# Altium schematic sheet 24V_Buck_3_3V.SchDoc
size A; SheetNumber: 13; SheetTotal: 13
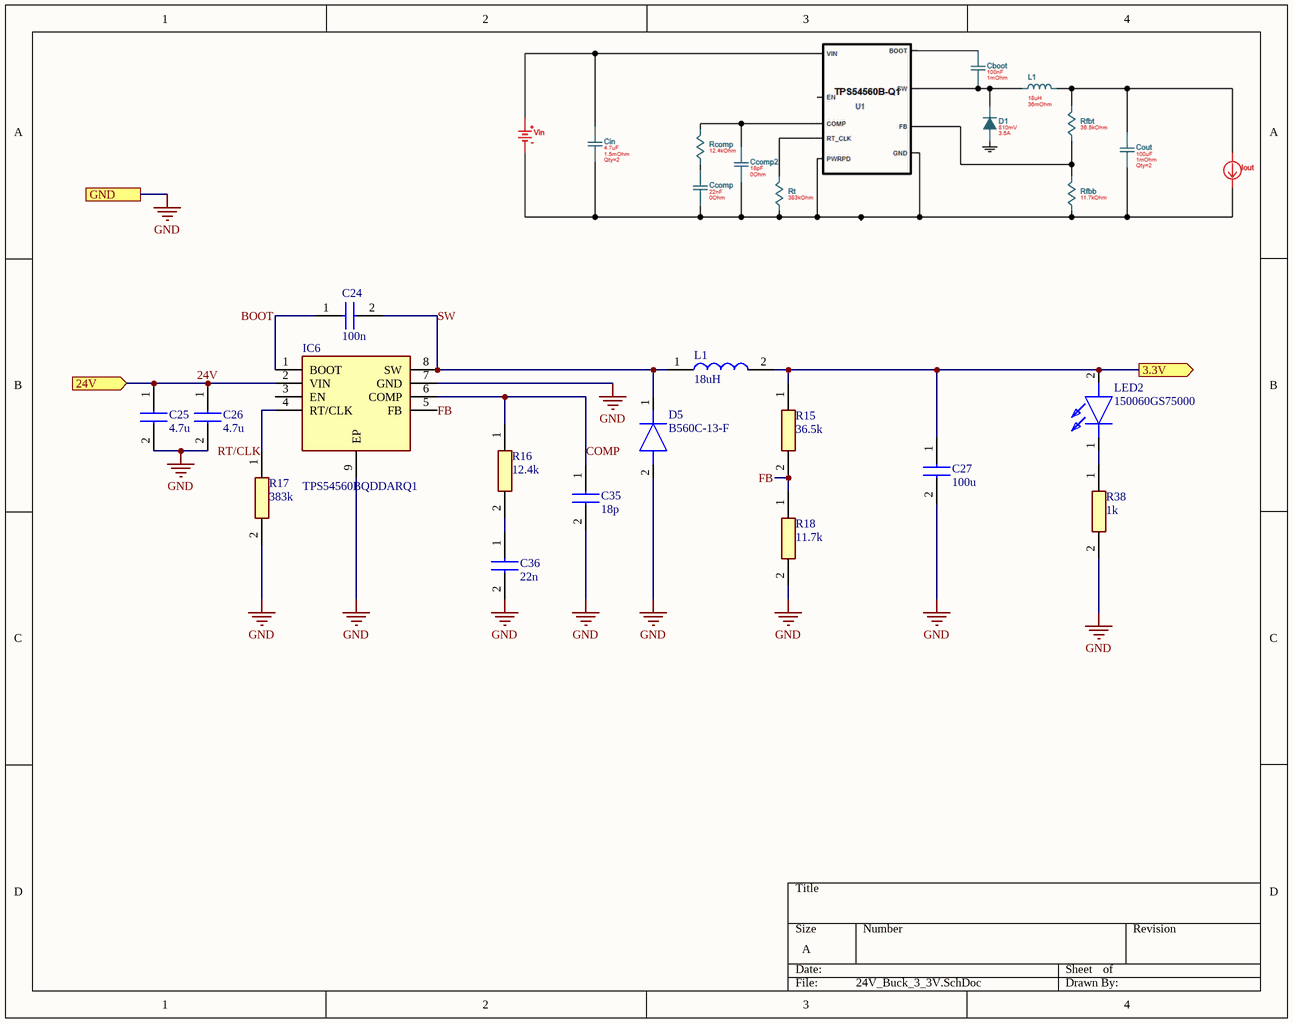
[diagram p0: 24V_Buck_3_3V.SchDoc]

## Parts
C24  100n  [CAPC1608X90N]
C25  4.7u  [CAPC2012X145N]
C26  4.7u  [CAPC2012X145N]
C27  100u  [CAPC3216X190N]
C35  18p  [CAPC1608X90N]
C36  22n  [CAPC1608X87N]
D5  B560C-13-F  [DIOM7959X250N]
IC6  TPS54560BQDDARQ1  [SOIC127P600X170-9N]
L1  18uH  [INDPM125125X800N]
LED2  150060GS75000  [LEDC1608X70N]
R15  36.5k  [RESC1608X55N]
R16  12.4k  [RESC1608X50N]
R17  383k  [RESC1608X55N]
R18  11.7k  [CAPC1608X55N]
R38  1k  [RESC1608X55N]

## Ports
3.3V (out), 24V (in), GND

## Nets
GND: C25.2 C26.2 C27.2 C35.2 C36.2 D5.2(A) IC6.7(GND) IC6.9(EP) R17.2 R18.2 R38.2 ; port GND
3.3V: C27.1 L1.2 LED2.2(A) R15.1 ; port 3.3V
24V: C25.1 C26.1 IC6.2(VIN) ; port 24V
BOOT: C24.1 IC6.1(BOOT)
COMP: C35.1 IC6.6(COMP) R16.1
FB: IC6.5(FB) R15.2 R18.1
RT/CLK: IC6.4(RT/CLK) R17.1
SW: C24.2 D5.1(K) IC6.8(SW) L1.1
NetC36_1: C36.1 R16.2
NetLED2_1: LED2.1(K) R38.1

Not connected (* = marked no-connect by the designer): IC6 3(EN)

## Library data of the parts
C24 = 06035C104J4Z2A: Capacitor; Manufacturer_Name: Kyocera AVX; Datasheet Link: https://componentsearchengine.com/Datasheets/1/06031A100FAT2A.pdf; Height: 0.9mm; Manufacturer_Part_Number: 06035C104J4Z2A; Mouser Part Number: 581-06035C104J4Z2A; Mouser Price/Stock: https://www.mouser.co.uk/ProductDetail/KYOCERA-AVX/06035C104J4Z2A?qs=Awwwc1gvTnlncvTGCFZvkw%3D%3D; Arrow Part Number: 06035C104J4Z2A; Arrow Price/Stock: https://www.arrow.com/en/products/06035c104j4z2a/avx
C25 C26 = GRM21BR61H475ME51L: Capacitor; Manufacturer_Name: Murata Electronics; Datasheet Link: https://search.murata.co.jp/Ceramy/image/img/A01X/G101/ENG/GRM21BR61H475ME51-01A.pdf; Height: 1.45mm; Manufacturer_Part_Number: GRM21BR61H475ME51L; Mouser Part Number: 81-GRM21BR61H475M51L; Mouser Price/Stock: https://www.mouser.co.uk/ProductDetail/Murata-Electronics/GRM21BR61H475ME51L?qs=eeBpzGFlv%252B%2Fg0wAeHy0eJw%3D%3D; Arrow Part Number: GRM21BR61H475ME51L; Arrow Price/Stock: https://www.arrow.com/en/products/grm21br61h475me51l/murata-manufacturing?region=nac
C27 = CL31X107MQKNNWE: Capacitor; Manufacturer_Name: SAMSUNG; Datasheet Link: https://www.digikey.sg/en/products/detail/samsung-electro-mechanics/CL31X107MQKNNWE/25854287?srsltid=AfmBOoqYZ52GRQ9Xlh8bi0lGOe-KtDJ1wz9-WyaigKcCVSEueXc8l4on; Height: 1.9mm; Manufacturer_Part_Number: CL31X107MQKNNWE; Mouser Part Number: 187-CL31X107MQKNNWE; Mouser Price/Stock: https://www.mouser.co.uk/ProductDetail/Samsung-Electro-Mechanics/CL31X107MQKNNWE?qs=Jm2GQyTW%2FbjTv%252BH%2F%252BndEuA%3D%3D
C35 = 06035A180JAT4A: Capacitor; Manufacturer_Name: Kyocera AVX; Datasheet Link: https://componentsearchengine.com/Datasheets/1/06031A100FAT2A.pdf; Height: 0.9mm; Manufacturer_Part_Number: 06035A180JAT4A; Mouser Part Number: 581-06035A180JAT4A; Mouser Price/Stock: https://www.mouser.co.uk/ProductDetail/AVX/06035A180JAT4A?qs=GMfvKSOiCGHkuDR8fcucAQ%3D%3D
C36 = C0603C223K5RAC-TU: Capacitor; Manufacturer_Name: KEMET; Datasheet Link: https://www.kemet.com/specsheet/C0603C223K5RACTU; Height: 0.87mm; Manufacturer_Part_Number: C0603C223K5RAC-TU
D5 = B560C-13-F: Diode; Manufacturer_Name: Diodes Incorporated; Datasheet Link: https://datasheet.lcsc.com/szlcsc/Diodes-Incorporated-B560C-13-F_C85100.pdf; Height: 2.5mm; Manufacturer_Part_Number: B560C-13-F; Mouser Part Number: 621-B560C-F; Mouser Price/Stock: https://www.mouser.co.uk/ProductDetail/Diodes-Incorporated/B560C-13-F?qs=OC0R%252Bhozcm%252BAsjMXklZLIw%3D%3D; Arrow Part Number: B560C-13-F; Arrow Price/Stock: https://www.arrow.com/en/products/b560c-13-f/diodes-incorporated?utm_currency=USD&region=nac
IC6 = TPS54560BQDDARQ1: Integrated Circuit; Manufacturer_Name: Texas Instruments; Datasheet Link: http://www.ti.com/lit/gpn/tps54560b-q1; Height: 1.7mm; Manufacturer_Part_Number: TPS54560BQDDARQ1; Mouser Part Number: 595-TPS54560BQDDARQ1; Mouser Price/Stock: https://www.mouser.co.uk/ProductDetail/Texas-Instruments/TPS54560BQDDARQ1?qs=Mv7BduZupUi0AsDfghsxzg%3D%3D; Arrow Part Number: TPS54560BQDDARQ1; Arrow Price/Stock: https://www.arrow.com/en/products/tps54560bqddarq1/texas-instruments?utm_currency=USD&region=nac
L1 = SRR1280-180M: Inductor; Manufacturer_Name: Bourns; Datasheet Link: https://www.bourns.com/docs/Product-Datasheets/SRR1280.pdf; Height: 8mm; Manufacturer_Part_Number: SRR1280-180M; Mouser Part Number: 652-SRR1280-180M; Mouser Price/Stock: https://www.mouser.co.uk/ProductDetail/Bourns/SRR1280-180M?qs=brMhP%2FMjUfeRcSm%2FRxSrFQ%3D%3D; Arrow Part Number: SRR1280-180M; Arrow Price/Stock: https://www.arrow.com/en/products/srr1280-180m/bourns?region=nac
LED2 = 150060GS75000: LED; Manufacturer_Name: Wurth Elektronik; Datasheet Link: https://www.we-online.com/catalog/datasheet/150060GS75000.pdf; Height: 0.7mm; Manufacturer_Part_Number: 150060GS75000; Mouser Part Number: 710-150060GS75000; Mouser Price/Stock: https://www.mouser.co.uk/ProductDetail/Wurth-Elektronik/150060GS75000?qs=LlUlMxKIyB0UYkq5lDO8nA%3D%3D
R15 = ERJ-3EKF3652V: Resistor; Manufacturer_Name: Panasonic; Datasheet Link: http://industrial.panasonic.com/cdbs/www-data/pdf/RDA0000/AOA0000C86.pdf; Height: 0.55mm; Manufacturer_Part_Number: ERJ-3EKF3652V; Mouser Part Number: 667-ERJ-3EKF3652V; Mouser Price/Stock: https://www.mouser.co.uk/ProductDetail/Panasonic/ERJ-3EKF3652V?qs=MVjVSMjNRMrgC1BnfDObyw%3D%3D; Arrow Part Number: ERJ-3EKF3652V; Arrow Price/Stock: https://www.arrow.com/en/products/erj-3ekf3652v/panasonic?region=nac
R16 = CRCW060312K4FKEA: Resistor; Manufacturer_Name: Vishay; Datasheet Link: http://www.vishay.com/docs/20035/dcrcwe3.pdf; Height: 0.5mm; Manufacturer_Part_Number: CRCW060312K4FKEA; Mouser Part Number: 71-CRCW0603-12.4K-E3; Mouser Price/Stock: https://www.mouser.co.uk/ProductDetail/Vishay-Dale/CRCW060312K4FKEA?qs=8tsW7z%2Fc78of4VB3wUPkkg%3D%3D; Arrow Part Number: CRCW060312K4FKEA; Arrow Price/Stock: https://www.arrow.com/en/products/crcw060312k4fkea/vishay?utm_currency=USD&region=nac
R17 = ERJ-3EKF3833V: Resistor; Manufacturer_Name: Panasonic; Datasheet Link: http://industrial.panasonic.com/cdbs/www-data/pdf/RDA0000/AOA0000C86.pdf; Height: 0.55mm; Manufacturer_Part_Number: ERJ-3EKF3833V; Mouser Part Number: 667-ERJ-3EKF3833V; Mouser Price/Stock: https://www.mouser.com/Search/Refine.aspx?Keyword=667-ERJ-3EKF3833V; Arrow Part Number: ERJ-3EKF3833V; Arrow Price/Stock: https://www.arrow.com/en/products/erj-3ekf3833v/panasonic
R18 = TNPW060311K7BEEA: Resistor; Manufacturer_Name: Vishay; Datasheet Link: https://componentsearchengine.com/Datasheets/1/TNPW060311K7BEEA.pdf; Height: 0.55mm; Manufacturer_Part_Number: TNPW060311K7BEEA; Mouser Part Number: 71-TNPW060311K7BEEA; Mouser Price/Stock: https://www.mouser.co.uk/ProductDetail/Vishay-Dale/TNPW060311K7BEEA?qs=ixLl9tGHk8sqv6nzL7A%252BsQ%3D%3D
R38 = RMCF0603JT1K00: Resistor; Manufacturer_Name: Stackpole Electronics; Datasheet Link: https://www.seielect.com/Catalog/SEI-RMCF_RMCP.pdf; Height: 0.55mm; Manufacturer_Part_Number: RMCF0603JT1K00; Mouser Part Number: 708-RMCF0603JT1K00; Mouser Price/Stock: https://www.mouser.co.uk/ProductDetail/SEI-Stackpole/RMCF0603JT1K00?qs=FESYatJ8odK3lrUeqnFxyg%3D%3D; Arrow Part Number: RMCF0603JT1K00; Arrow Price/Stock: https://www.arrow.com/en/products/rmcf0603jt1k00/stackpole-electronics?region=nac